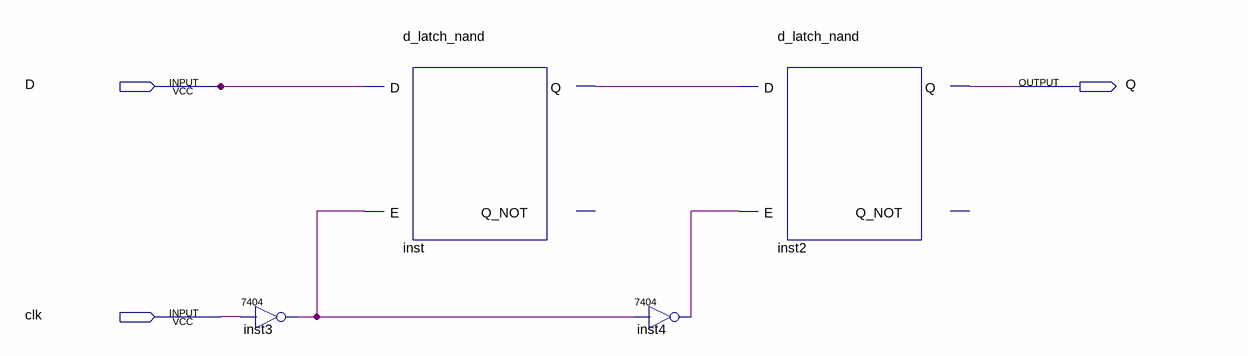
[diagram p0: schematic sheet]
// Quartus schematic d_ff_nand.bdf as structural Verilog: 4 symbols, 3 pins
module d_ff_nand (
  input  D,
  input  clk,
  output Q
);

  wire inst3_1, inst4_1, inst_q;

  \7404  inst3 (.\2 (clk), .\1 (inst3_1));
  d_latch_nand inst (.D(D), .E(inst3_1), .Q(inst_q));  // open: Q_NOT
  \7404  inst4 (.\2 (inst3_1), .\1 (inst4_1));
  d_latch_nand inst2 (.D(inst_q), .E(inst4_1), .Q(Q));  // open: Q_NOT
endmodule
